# EAGLE design V0.1 (EAGLE 7.3.0)
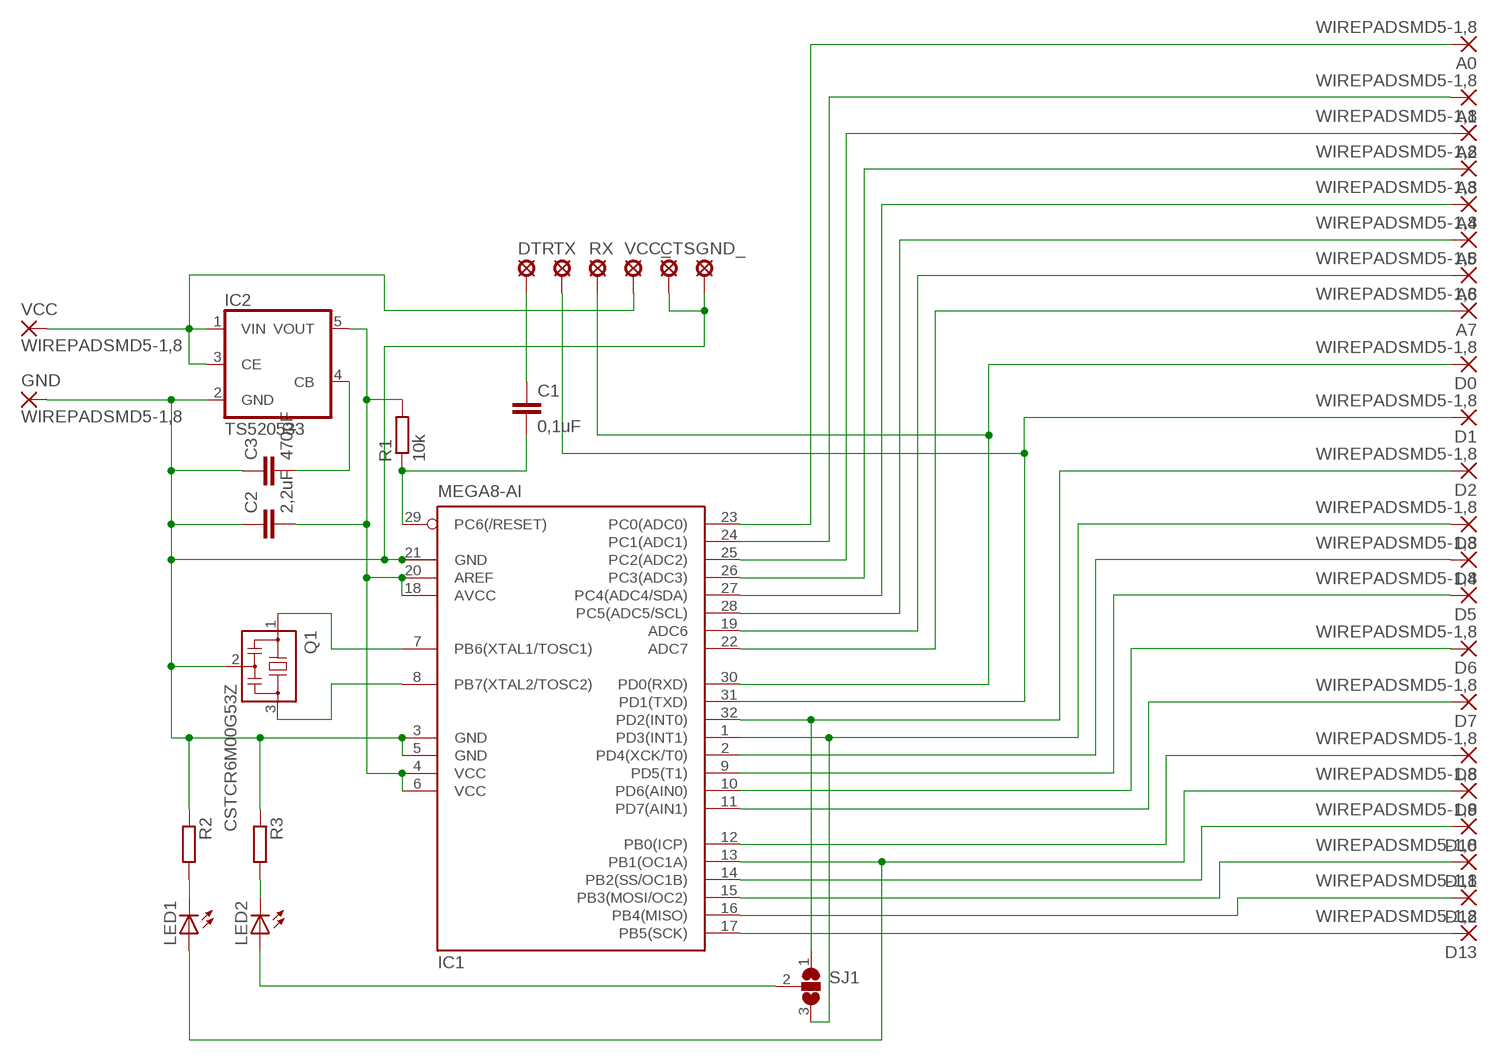
[diagram p0: schematic, sheet 1]

## Parts
A0  WIREPADSMD5-1,8  [5-1,8]
A1  WIREPADSMD5-1,8  [5-1,8]
A2  WIREPADSMD5-1,8  [5-1,8]
A3  WIREPADSMD5-1,8  [5-1,8]
A4  WIREPADSMD5-1,8  [5-1,8]
A5  WIREPADSMD5-1,8  [5-1,8]
A6  WIREPADSMD5-1,8  [5-1,8]
A7  WIREPADSMD5-1,8  [5-1,8]
C1  0,1uF  C-EUC0603  [C0603]
C2  2,2uF  C-EUC0603  [C0603]
C3  470pF  C-EUC0603  [C0603]
CTS  LSP10  [LSP10]
D0  WIREPADSMD5-1,8  [5-1,8]
D1  WIREPADSMD5-1,8  [5-1,8]
D2  WIREPADSMD5-1,8  [5-1,8]
D3  WIREPADSMD5-1,8  [5-1,8]
D4  WIREPADSMD5-1,8  [5-1,8]
D5  WIREPADSMD5-1,8  [5-1,8]
D6  WIREPADSMD5-1,8  [5-1,8]
D7  WIREPADSMD5-1,8  [5-1,8]
D8  WIREPADSMD5-1,8  [5-1,8]
D9  WIREPADSMD5-1,8  [5-1,8]
D10  WIREPADSMD5-1,8  [5-1,8]
D11  WIREPADSMD5-1,8  [5-1,8]
D12  WIREPADSMD5-1,8  [5-1,8]
D13  WIREPADSMD5-1,8  [5-1,8]
DTR  LSP10  [LSP10]
GND  WIREPADSMD5-1,8  [5-1,8]
GND_  LSP10  [LSP10]
IC1  MEGA8-AI  [TQFP32-08]
IC2  TS520533  [SOT25]
LED1  LEDCHIP-LED0603  [CHIP-LED0603]
LED2  LEDCHIP-LED0603  [CHIP-LED0603]
Q1  CSTCR6M00G53Z  [CSTCR6M]
R1  10k  R-EU_R0603  [R0603]
R2  R-EU_R0603  [R0603]
R3  R-EU_R0603  [R0603]
RX  LSP10  [LSP10]
SJ1  SJ2W  [SJ_2]
TX  LSP10  [LSP10]
VCC  WIREPADSMD5-1,8  [5-1,8]
VCC_  LSP10  [LSP10]

## Nets
N$1: IC1.8(PB7(XTAL2/TOSC2)) Q1.3
N$2: IC1.7(PB6(XTAL1/TOSC1)) Q1.1
N$3: C2.1 C3.1 CTS.MP GND.1(P) GND_.MP IC1.3(GND) IC1.5(GND) IC1.21(GND) IC2.2(GND) Q1.2 R2.1 R3.1
N$4: IC2.1(VIN) IC2.3(CE) VCC.1(P) VCC_.MP
N$5: C2.2 IC1.4(VCC) IC1.6(VCC) IC1.18(AVCC) IC1.20(AREF) IC2.5(VOUT) R1.2
N$6: D2.1(P) IC1.32(PD2(INT0)) SJ1.1
N$7: D1.1(P) IC1.31(PD1(TXD)) TX.MP
N$8: D0.1(P) IC1.30(PD0(RXD)) RX.MP
N$9: D3.1(P) IC1.1(PD3(INT1)) SJ1.3
N$10: D4.1(P) IC1.2(PD4(XCK/T0))
N$11: D5.1(P) IC1.9(PD5(T1))
N$12: D6.1(P) IC1.10(PD6(AIN0))
N$13: D7.1(P) IC1.11(PD7(AIN1))
N$14: D8.1(P) IC1.12(PB0(ICP))
N$15: D9.1(P) IC1.13(PB1(OC1A)) LED1.A
N$16: D10.1(P) IC1.14(PB2(SS/OC1B))
N$17: D11.1(P) IC1.15(PB3(MOSI/OC2))
N$18: D12.1(P) IC1.16(PB4(MISO))
N$19: D13.1(P) IC1.17(PB5(SCK))
N$20: A0.1(P) IC1.23(PC0(ADC0))
N$21: A1.1(P) IC1.24(PC1(ADC1))
N$22: A2.1(P) IC1.25(PC2(ADC2))
N$23: A3.1(P) IC1.26(PC3(ADC3))
N$24: A4.1(P) IC1.27(PC4(ADC4/SDA))
N$25: A5.1(P) IC1.28(PC5(ADC5/SCL))
N$26: A6.1(P) IC1.19(ADC6)
N$27: A7.1(P) IC1.22(ADC7)
N$28: LED1.C R2.2
N$29: LED2.C R3.2
N$30: C1.2 IC1.29(PC6(/RESET)) R1.1
N$31: C1.1 DTR.MP
N$32: LED2.A SJ1.2
N$34: C3.2 IC2.4(CB)

## Library data of the parts
A0 A1-A7 D0 D1-D13 GND VCC = wirepad:WIREPAD: Wire PAD connect wire on PCB
C1-C3 = rcl:C-EU: CAPACITOR, European symbol
CTS DTR GND_ RX TX VCC_ = solpad:LSP10: SOLDER PAD drill 1.0 mm, distributor Buerklin, 12H555
IC1 = atmel:MEGA8: MICROCONTROLLER 8 Kbytes FLASH, 1 kbytes SRAM, 512 bytes EEPROM, USART, 6-channel 10 bit ADC, 2-channel 8 bit ADC Pin compatible with Atmega48, ATMega88, ATMega168 Source: avr.lbr; MPN: ATMEGA328P-16AU
IC2 = v-reg:TS5205: 150mA Low Noise LDO Voltage Regulator with Enable TSC [Taiwan Semiconductor Company, Ltd] Source: http://www.taiwansemi.com .. 5205_0409c.pdf
LED1 LED2 = led:LED: LED OSRAM: - CHIPLED LG R971, LG N971, LY N971, LG Q971, LY Q971, LO R971, LY R971 LH N974, LH R974 LS Q976, LO Q976, LY Q976 LO Q996 - Hyper CHIPLED LW Q18S LB Q993, LB Q99A, LB R99A - SideLED LS A670, LO A670, LY A670, LG A670, LP A670 LB A673, LV A673, LT A673, LW A673 LH A674 LY A675 LS A676, LA A676, LO A676, LY A676, LW A676 LS A679, LY A679, LG A679 - Hyper Micro SIDELED® LS Y876, LA Y876, LO Y876, LY Y876 LT Y87S - SmartLED LW L88C, LW L88S LB L89C, LB L89S, LG L890 LS L89K, LO L89K, LY L89K LS L896, LA L896, LO L896, LY L896 - TOPLED LS T670, LO T670, LY T670, LG T670, LP T670 LSG T670, LSP T670, LSY T670, LOP T670, LYG T670 LG T671, LOG T671, LSG T671 LB T673, LV T673, LT T673, LW T673 LH T674 LS T676, LA T676, LO T676, LY T676, LB T676, LH T676, LSB T676, LW T676 LB T67C, LV T67C, LT T67C, LS T67K, LO T67K, LY T67K, LW E67C LS E67B, LA E67B, LO E67B, LY E67B, LB E67C, LV E67C, LT E67C LW T67C LS T679, LY T679, LG T679 LS T770, LO T770, LY T770, LG T770, LP T770 LB T773, LV T773, LT T773, LW T773 LH T774 LS E675, LA E675, LY E675, LS T675 LS T776, LA T776, LO T776, LY T776, LB T776 LHGB T686 LT T68C, LB T68C - Hyper Mini TOPLED® LB M676 - Mini TOPLED Santana® LG M470 LS M47K, LO M47K, LY M47K Source: http://www.osram.convergy.de LUXEON: - LUMILED® LXK2-PW12-R00, LXK2-PW12-S00, LXK2-PW14-U00, LXK2-PW14-V00 LXK2-PM12-R00, LXK2-PM12-S00, LXK2-PM14-U00 LXK2-PE12-Q00, LXK2-PE12-R00, LXK2-PE12-S00, LXK2-PE14-T00, LXK2-PE14-U00 LXK2-PB12-K00, LXK2-PB12-L00, LXK2-PB12-M00, LXK2-PB14-N00, LXK2-PB14-P00, LXK2-PB14-Q00 LXK2-PR12-L00, LXK2-PR12-M00, LXK2-PR14-Q00, LXK2-PR14-R00 LXK2-PD12-Q00, LXK2-PD12-R00, LXK2-PD12-S00 LXK2-PH12-R00, LXK2-PH12-S00 LXK2-PL12-P00, LXK2-PL12-Q00, LXK2-PL12-R00 Source: www.luxeon.com KINGBRIGHT: KA-3528ASYC Source: www.kingbright.com
Q1 = murata-filter:CSTCR: Resonator Source: murata.co.jp; MPN: CSTCR6M00G53-R0; OC_FARNELL: 1170434; OC_NEWARK: 25M8759
R1-R3 = rcl:R-EU_: RESISTOR, European symbol
SJ1 = jumper:SJ2W: SMD solder JUMPER

## Board
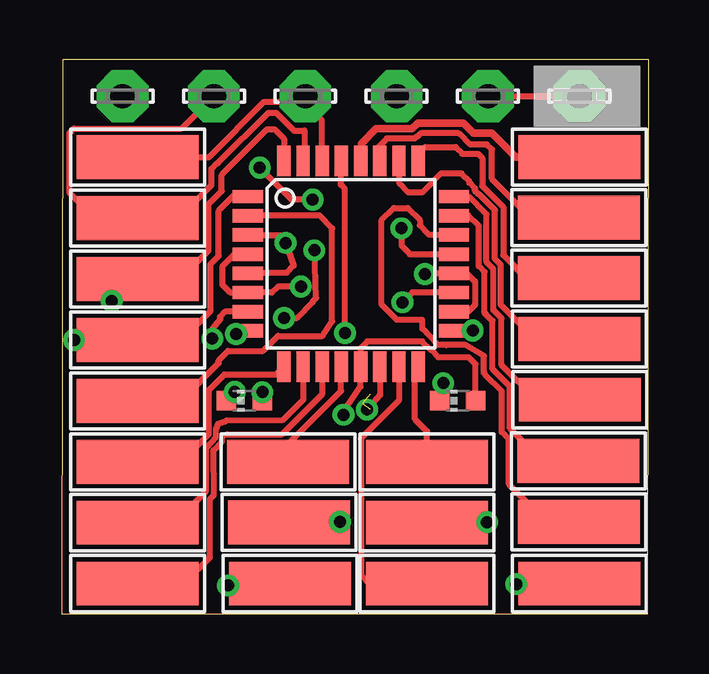
[diagram p1: board, top side]
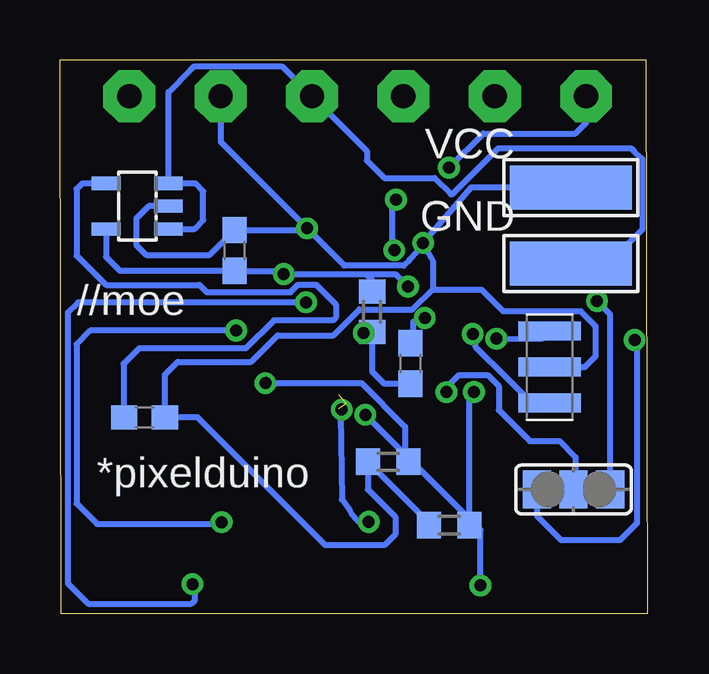
[diagram p2: board, bottom side, seen from below]

Size 24.48 x 23.1 mm. Coordinates in mm from the lower left corner, seen from the top.
Outline: 0,0 24.44,0 24.48,23.1 0.05,23.1 0,0
Copper layers (1*16): Top 0.035mm / dielectric 1.5mm / Bottom 0.035mm
Design rules "default": minimum track width 10mil, minimum drill 24mil, track to track 8mil, track to pad 8mil, pad to pad 8mil, via to via 8mil, smd to smd 8mil, copper to edge 40mil, drill to drill 8mil, minimum pad ring 10mil, minimum via ring 8mil, stop-mask expansion 4mil, vias tented up to drill 0mil, thermal gap 10mil

### Footprints (pad centres in the part's own frame; a part is rotated, then mirrored left to right if it is on the bottom)
5-1,8 = smd 1.829 x 5.08: 1 0,0
C0603 = smd 1.1 x 1: 1 -0.85,0; 2 0.85,0
LSP10 = drill 1.016 pad 2.159 octagon: MP 0,0
TQFP32-08 = smd 1.27 x 0.559: 1 -4.293,2.8; 2 -4.293,2; 3 -4.293,1.2; 4 -4.293,0.4; 5 -4.293,-0.4; 6 -4.293,-1.2; 7 -4.293,-2; 8 -4.293,-2.8; 17 4.293,-2.8; 18 4.293,-2; 19 4.293,-1.2; 20 4.293,-0.4; 21 4.293,0.4; 22 4.293,1.2; 23 4.293,2; 24 4.293,2.8 | smd 0.559 x 1.27: 9 -2.8,-4.293; 10 -2,-4.293; 11 -1.2,-4.293; 12 -0.4,-4.293; 13 0.4,-4.293; 14 1.2,-4.293; 15 2,-4.293; 16 2.8,-4.293; 25 2.8,4.293; 26 2,4.293; 27 1.2,4.293; 28 0.4,4.293; 29 -0.4,4.293; 30 -1.2,4.293; 31 -2,4.293; 32 -2.8,4.293
SOT25 = smd 0.55 x 1.2: 1 -0.95,-1.3; 2 0,-1.3; 3 0.95,-1.3; 4 0.95,1.3; 5 -0.95,1.3
CHIP-LED0603 = smd 0.8 x 0.8: A 0,-0.75; C 0,0.75
CSTCR6M = smd 0.8 x 2.6: 1 -1.5,0; 2 0,0; 3 1.5,0
R0603 = smd 1 x 1.1: 1 -0.85,0; 2 0.85,0
SJ_2 = smd 1.168 x 1.6: 1 -1.524,0; 2 0,0; 3 1.524,0

### Placement (x,y rotation side)
A0  21.54,6.39 90 top
A1  21.61,8.94 90 top
A2  21.57,14.01 90 top
A3  21.59,11.47 90 top
A4  21.57,16.53 90 top
A5  21.59,19.05 90 top
A6  21.59,1.27 270 top
A7  21.57,3.84 90 top
C1  9.87,10.45 270 bottom
C2  17.2,15.16 270 bottom
C3  20.95,8.2 180 bottom
CTS  17.78,21.59 0 top
D0  3.18,19.05 90 top
D1  3.18,16.51 90 top
D2  3.18,13.97 90 top
D3  3.18,11.43 90 top
D4  3.18,8.89 90 top
D5  3.18,6.35 90 top
D6  3.18,3.81 90 top
D7  3.18,1.27 90 top
D8  9.44,6.34 90 top
D9  9.53,1.27 90 top
D10  9.48,3.82 90 top
D11  15.24,1.27 90 top
D12  15.24,6.35 90 top
D13  15.24,3.81 90 top
DTR  2.54,21.59 0 top
GND  3.18,17.78 270 bottom
GND_  21.59,21.59 0 top
IC1  12.07,14.6 0 top
IC2  21.26,17.01 90 bottom
LED1  16.51,8.89 90 top
LED2  7.62,8.89 90 top
Q1  4.07,10.29 270 bottom
R1  11.46,12.61 90 bottom
R2  10.8,6.35 0 bottom
R3  8.26,3.71 0 bottom
RX  10.16,21.59 0 top
SJ1  3.07,5.19 180 bottom
TX  6.35,21.59 0 top
U$1  [//MOE]  23.78,12.45 0 bottom
U$2  [ARDUINO]  20.41,2.72 0 bottom
VCC  3.18,14.6 270 bottom
VCC_  13.97,21.59 0 top

### Tracks (layer width: path | path; a pad name or v marks a point on that pad's centre or on a via)
N$1  (via drill 0.5 pad 0.25)
  Top 0.254: v7.27,11.68 7.73,11.76 IC1.8
  Bottom 0.254: Q1.3 4.8,8.79 5.85,9.84 5.85,9.85 7.15,11.14 7.15,11.65 v7.27,11.68
N$2  (via drill 0.5 pad 0.25)
  Top 0.254: IC1.7 6.82,12.6 6.61,12.39 6.61,12.27 6.28,11.88 v6.28,11.48
  Bottom 0.254: v6.28,11.48 4.39,11.47 Q1.1
N$3  (via drill 0.5 pad 0.25)
  Top 0.254: CTS.MP GND_.MP | v14.18,16.08 14.18,15.36 14.52,15.01 IC1.21 | IC1.3 9.32,15.8 v9.34,15.47 9.68,14.52 9.38,14.23 7.79,14.23 IC1.5
  Bottom 0.254: CTS.MP 17.78,19.69 v14.18,16.08 | v9.34,15.47 9.32,15.38 9.9,14.79 10.16,14.53 12.62,14.53 v14.18,16.08 | 14.15,16.06 v14.18,16.08 | v14.18,16.08 14.25,16.01 C2.1 18.24,14.97 20.88,14.97 21.3,15.38 21.3,16.49 20.78,17.01 IC2.2 | 8.92,13.56 9.77,12.7 12,12.7 13.08,11.62 15.41,11.62 16.51,10.52 19.57,10.52 20.11,9.98 C3.1 18.74,8.2 13.42,2.87 10.95,2.87 10.49,3.33 10.49,4.04 11.65,5.19 R2.1 9.11,3.81 R3.1 | 8.92,13.56 8.92,14.69 v9.34,15.47 | GND.1 7.34,17.78 v9.34,15.47 | Q1.2 2.6,10.29 2.14,10.75 2.14,11.99 2.76,12.62 5.99,12.62 6.89,13.51 8.87,13.51 8.92,13.56
N$4
  Bottom 0.254: IC2.1 18.88,16.05 18.5,16.43 18.5,17.62 18.83,17.95 IC2.3 19.96,21.76 19.03,22.69 | VCC.1 1.64,14.6 0.19,16.06 0.19,18.95 0.25,19.01 0.55,19.31 0.66,19.42 6.2,19.42 8.13,17.5 8.18,17.5 8.86,18.18 10.95,18.18 11.69,18.91 11.69,19.31 VCC_.MP 15.22,22.84 18.88,22.84 19.03,22.69 | 19.03,22.69
N$5  (via drill 0.5 pad 0.25)
  Top 0.254: IC1.4 7.22,15.01 6.7,14.49 6.7,13.74 7.03,13.41 IC1.6 8.76,13.4 9.02,13.65 v9.98,13.65 | IC1.18 16.96,12.61 17.24,12.89 17.24,13.86 16.9,14.21 IC1.20 15.18,14.21 v15.15,14.17
  Bottom 0.254: 11.72,14.17 v15.15,14.17 15.29,14.31 C2.2 21.98,14.31 22.56,14.89 IC2.5 | 11.72,14.17 10.5,14.17 v9.98,13.65 | R1.2 11.47,13.92 11.72,14.17
N$6  (via drill 0.5 pad 0.25)
  Top 0.254: IC1.32 9.27,19.83 8.89,20.21 8.56,20.21 6.69,18.34 6.69,18.32 6.67,18.3 6.67,17.63 6.12,17.08 6.12,15.15 4.94,13.97 D2.1 2.23,13.05 v2.09,13.05
  Bottom 0.254: SJ1.1 1.54,12.48 v2.09,13.05
N$7
  Top 0.254: IC1.31 10.12,18.96 10.12,20.17 10.11,20.15 9.7,20.15 8.95,20.9 8.62,20.9 6.51,18.79 6.47,18.79 6.25,18.57 6.25,17.88 4.88,16.51 D1.1 1.38,16.51 0.33,17.56 0.33,20.06 0.51,20.24 5,20.24 TX.MP
N$8
  Top 0.254: D0.1 6.14,19.05 8.45,21.35 9.93,21.35 | 9.93,21.35 RX.MP | 9.93,21.35 10.1,21.35 10.84,20.62 10.84,18.93 IC1.30
N$9  (via drill 0.5 pad 0.25)
  Top 0.254: IC1.1 7.73,17.45 7.18,17.45 6.55,16.82 6.55,14.93 6.21,14.58 6.21,12.63 5,11.43 D3.1 v0.52,11.42
  Bottom 0.254: SJ1.3 4.59,4.09 3.59,3.09 1.12,3.09 0.42,3.79 0.42,11.32 v0.52,11.42
N$10
  Top 0.254: D4.1 4.98,8.89 6.55,10.46 6.55,10.58 6.94,10.97 8.4,10.97 9.03,11.6 10.89,11.6 11.28,12.2 11.28,16.08 10.75,16.62 IC1.2
N$11
  Top 0.254: D5.1 4.98,6.35 6.14,7.51 6.14,9.34 6.79,9.99 8.95,9.99 IC1.9
N$12
  Top 0.254: D6.1 4.71,3.81 6.02,5.12 6.03,6.92 6.43,7.39 6.44,7.7 6.54,7.94 6.86,8.05 6.89,8.08 9.23,8.1 10.08,8.94 10.08,10.3 IC1.10
N$13
  Top 0.254: D7.1 5.1,1.27 6.19,2.36 6.19,4.8 6.36,4.97 6.33,6.83 6.69,7.19 6.72,7.44 6.9,7.5 9.18,7.49 10.87,9.18 IC1.11
N$14
  Top 0.254: D8.1 9.44,7.09 11.66,9.31 IC1.12
N$15  (via drill 0.5 pad 0.25)
  Top 0.254: D9.1 7.03,1.27 v6.94,1.19 | v11.75,8.31 11.74,8.4 12.47,9.48 12.48,10.3 IC1.13 12.46,11.08 12.75,11.36 15.02,11.37 15.38,11.03 15.42,11 15.71,10.71 16.98,10.71 17.26,10.42 LED1.A
  Bottom 0.254: v6.94,1.19 6.94,3.51 v11.75,8.31
N$16  (via drill 0.5 pad 0.25)
  Top 0.254: IC1.14 13.27,9.13 12.83,8.62 v12.73,8.52 | v11.61,3.84 9.5,3.84 D10.1
  Bottom 0.254: v12.73,8.52 12.77,8.32 12.73,4.77 12.4,4.34 12.32,4.17 12.07,3.9 12,3.83 11.62,3.83 v11.61,3.84
N$17
  Top 0.254: IC1.15 14.07,8.9 12.48,7.31 12.48,1.62 12.86,1.24 15.21,1.24 D11.1
N$18
  Top 0.254: D12.1 15.24,7.62 14.74,8.12 14.74,10.19 IC1.16
N$19  (via drill 0.5 pad 0.25)
  Top 0.254: IC1.17 v17.13,11.8 v17.14,11.82 | v17.74,3.83 15.26,3.83 D13.1
  Bottom 0.254: v17.14,11.82 23.22,11.82 23.79,11.25 23.79,4.61 22.94,3.75 17.82,3.75 v17.74,3.83
N$20
  Top 0.254: A0.1 20.05,6.39 18.7,7.74 18.7,9.49 18.03,10.17 18.02,10.17 17.97,10.22 17.97,12.22 17.68,12.52 | 17.68,12.52 | 17.68,12.52 17.63,12.57 17.63,14.26 17.39,14.5 17.39,16.19 16.94,16.64 16.39,16.64 IC1.23
N$21
  Top 0.254: A1.1 19.8,8.94 18.34,10.39 18.34,12.34 18,12.68 18,14.38 17.72,14.67 17.72,16.66 16.98,17.4 IC1.24
N$22
  Top 0.254: IC1.25 14.87,19.18 15.16,19.48 16.42,19.48 16.71,19.19 17.36,19.19 17.54,19.01 17.54,17.85 18.41,16.98 18.41,14.96 19.51,13.87 21.43,13.87 A2.1
N$23
  Top 0.254: A3.1 19.73,11.47 18.31,12.89 18.31,14.56 18.07,14.8 18.07,16.83 17.38,17.52 17.35,17.52 17.24,17.63 17.24,17.74 16.99,17.98 16.99,18.05 16.68,18.37 15.83,18.37 15.04,17.58 14.45,17.58 14.09,17.94 14.09,18.87 IC1.26
N$24
  Top 0.254: A4.1 19.55,16.53 17.95,18.13 17.95,19.38 17.74,19.58 17.03,19.58 16.56,20.05 14.98,20.05 14.86,19.92 14.82,19.92 14.72,19.82 13.56,19.82 13.21,19.48 13.21,18.95 IC1.27
N$25
  Top 0.305: A5.1 18.94,19.05 17.95,20.05 17.17,20.05 16.75,20.47 14.86,20.47 14.61,20.23 13.11,20.23 12.5,19.62 12.5,18.93 IC1.28
N$26  (via drill 0.5 pad 0.25)
  Top 0.254: IC1.19 14.63,13.4 v14.22,12.99 | v18.96,1.24 21.56,1.24 A6.1
  Bottom 0.254: v14.22,12.99 23.73,12.99 24.15,12.57 24.15,1.28 23.31,0.43 18.99,0.43 18.85,0.58 18.85,1.14 v18.96,1.24
N$27
  Top 0.254: A7.1 20.23,3.84 18.66,5.41 18.66,7.29 18.35,7.59 18.35,9.3 17.66,9.99 17.64,10.03 17.61,10.1 17.61,10.76 16.84,11.22 16.04,11.22 15.69,11.22 15.05,11.9 15.04,12.27 13.98,12.26 13.34,12.91 13.34,16.43 13.85,16.94 14.43,16.94 14.93,16.43 14.93,16.21 15.32,15.82 16.34,15.82 IC1.22
  Top 0.305: 16.37,15.82 IC1.22
N$28  (via drill 0.5 pad 0.25)
  Top 0.254: LED1.C 15.76,9.47 v15.91,9.62
  Bottom 0.254: v15.91,9.62 11.91,9.62 10.09,7.8 10.09,6.49 R2.2
N$29  (via drill 0.5 pad 0.25)
  Top 0.254: v7.22,9.26 7.25,9.26 LED2.C
  Bottom 0.254: R3.2 7.41,9.28 v7.22,9.26
N$30  (via drill 0.5 pad 0.25)
  Top 0.254: v11.82,11.72 11.82,17.72 11.64,17.89 11.64,18.87 IC1.29
  Bottom 0.254: C1.2 9.88,9.61 10.96,9.61 11.47,10.11 R1.1 11.78,11.76 v11.82,11.72
N$31  (via drill 0.5 pad 0.25)
  Top 0.254: v9.27,12.35 9.81,12.35 10.47,13 10.47,13.03 10.62,13.19 v10.54,15.17 | v10.47,17.28 9.59,17.28 v8.26,18.61
  Bottom 0.254: C1.1 9.74,11.29 9.74,12.18 9.44,12.18 v9.27,12.35 | v10.54,15.17 10.62,15.44 10.62,17.13 v10.47,17.28 | v8.26,18.61 | v8.26,18.61 6.83,20.04 2.98,20.04 2.55,20.47 DTR.MP
N$32  (via drill 0.5 pad 0.25)
  Top 0.254: LED2.A v8.37,9.25
  Bottom 0.254: v8.37,9.25 8.37,9.59 8.22,9.59 7.85,9.96 6.64,9.96 6.18,9.5 6.18,8.5 4.89,7.21 3.65,7.21 2.98,6.54 2.98,5.28 SJ1.2
N$33  (2 unrouted)
N$34
  Bottom 0.254: IC2.4 23.55,17.95 23.78,17.72 23.78,14.94 22.56,13.72 18.66,13.72 18.36,13.42 14.86,13.42 14.55,13.73 13.8,13.73 12.98,12.91 12.98,12.37 13.1,12.25 15.56,12.25 16.73,11.08 21.18,11.08 21.83,10.43 21.83,8.22 C3.2